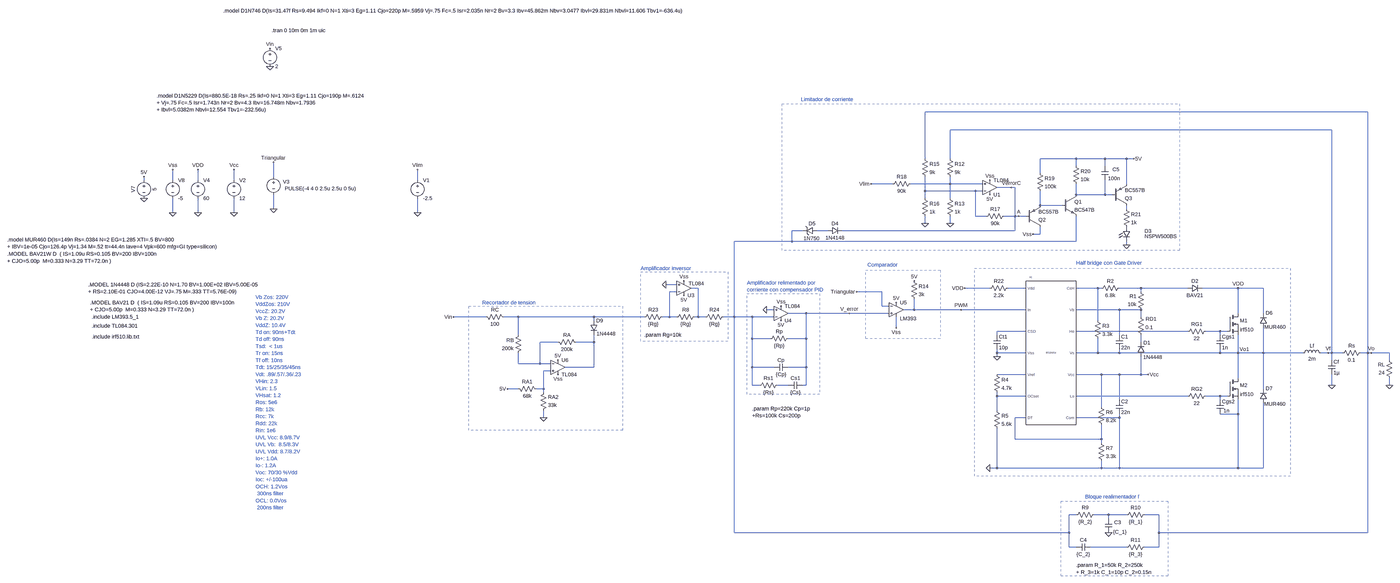
[diagram p0: schematic CIRCUITO_FINAL_POTENCIA.asc, whole sheet]
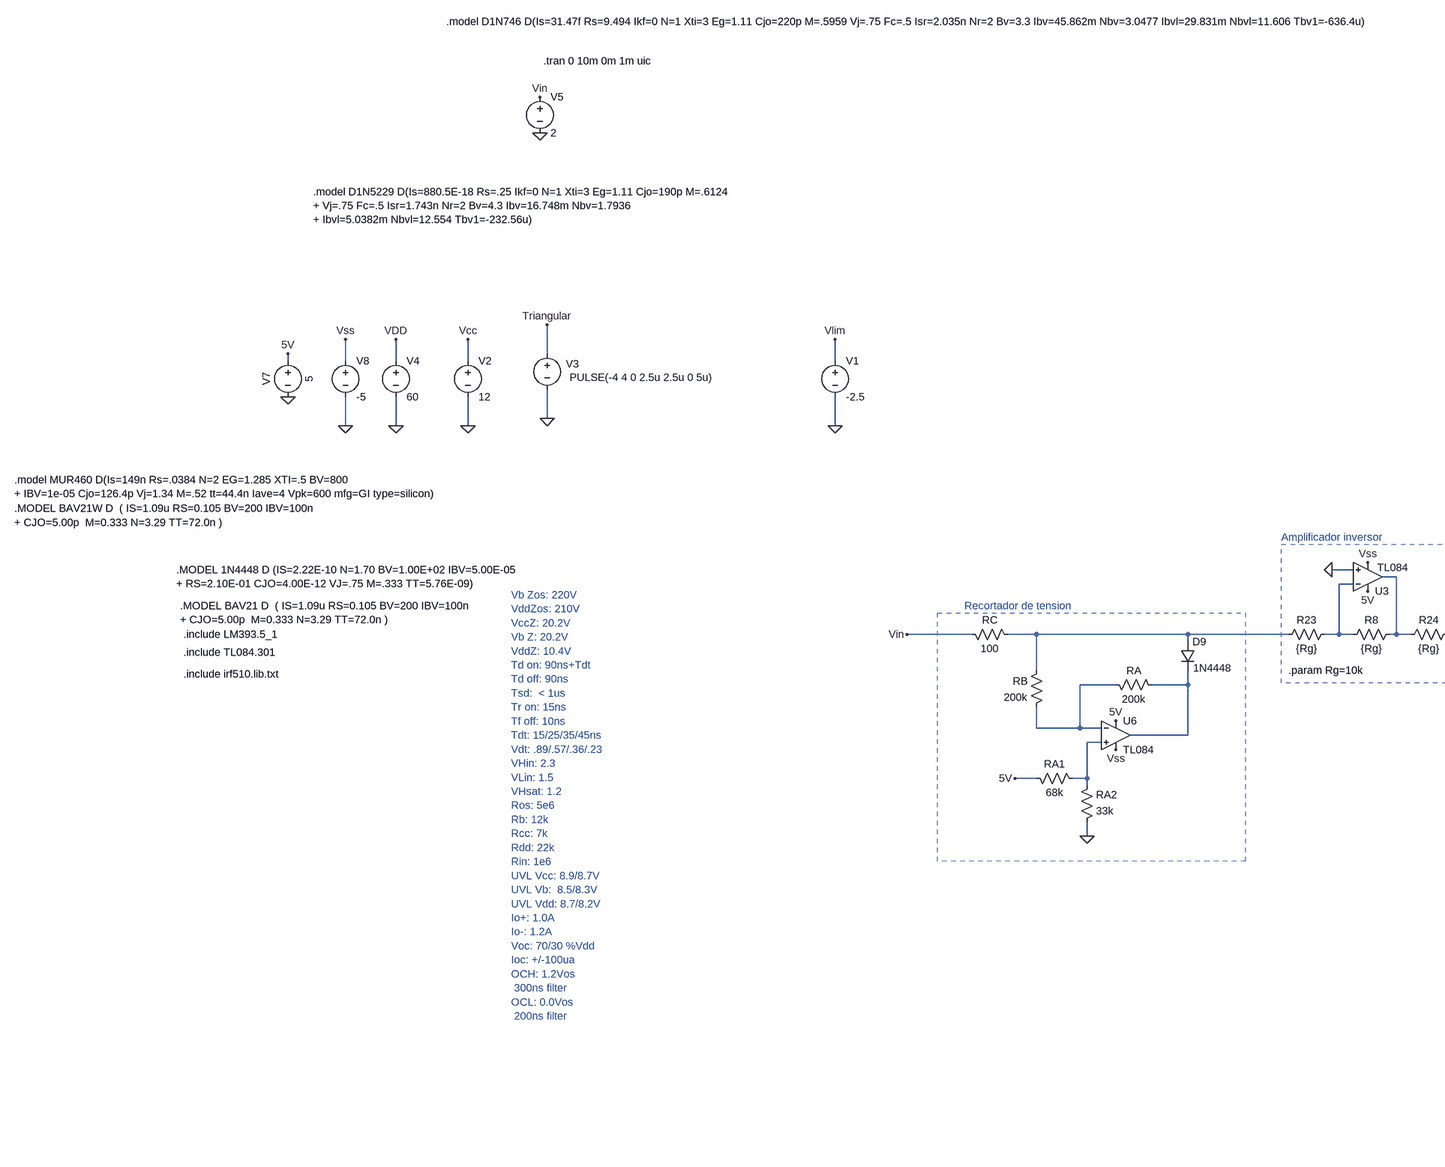
[diagram p1: schematic CIRCUITO_FINAL_POTENCIA.asc, part, row 1 of 1, column 1 of 2]
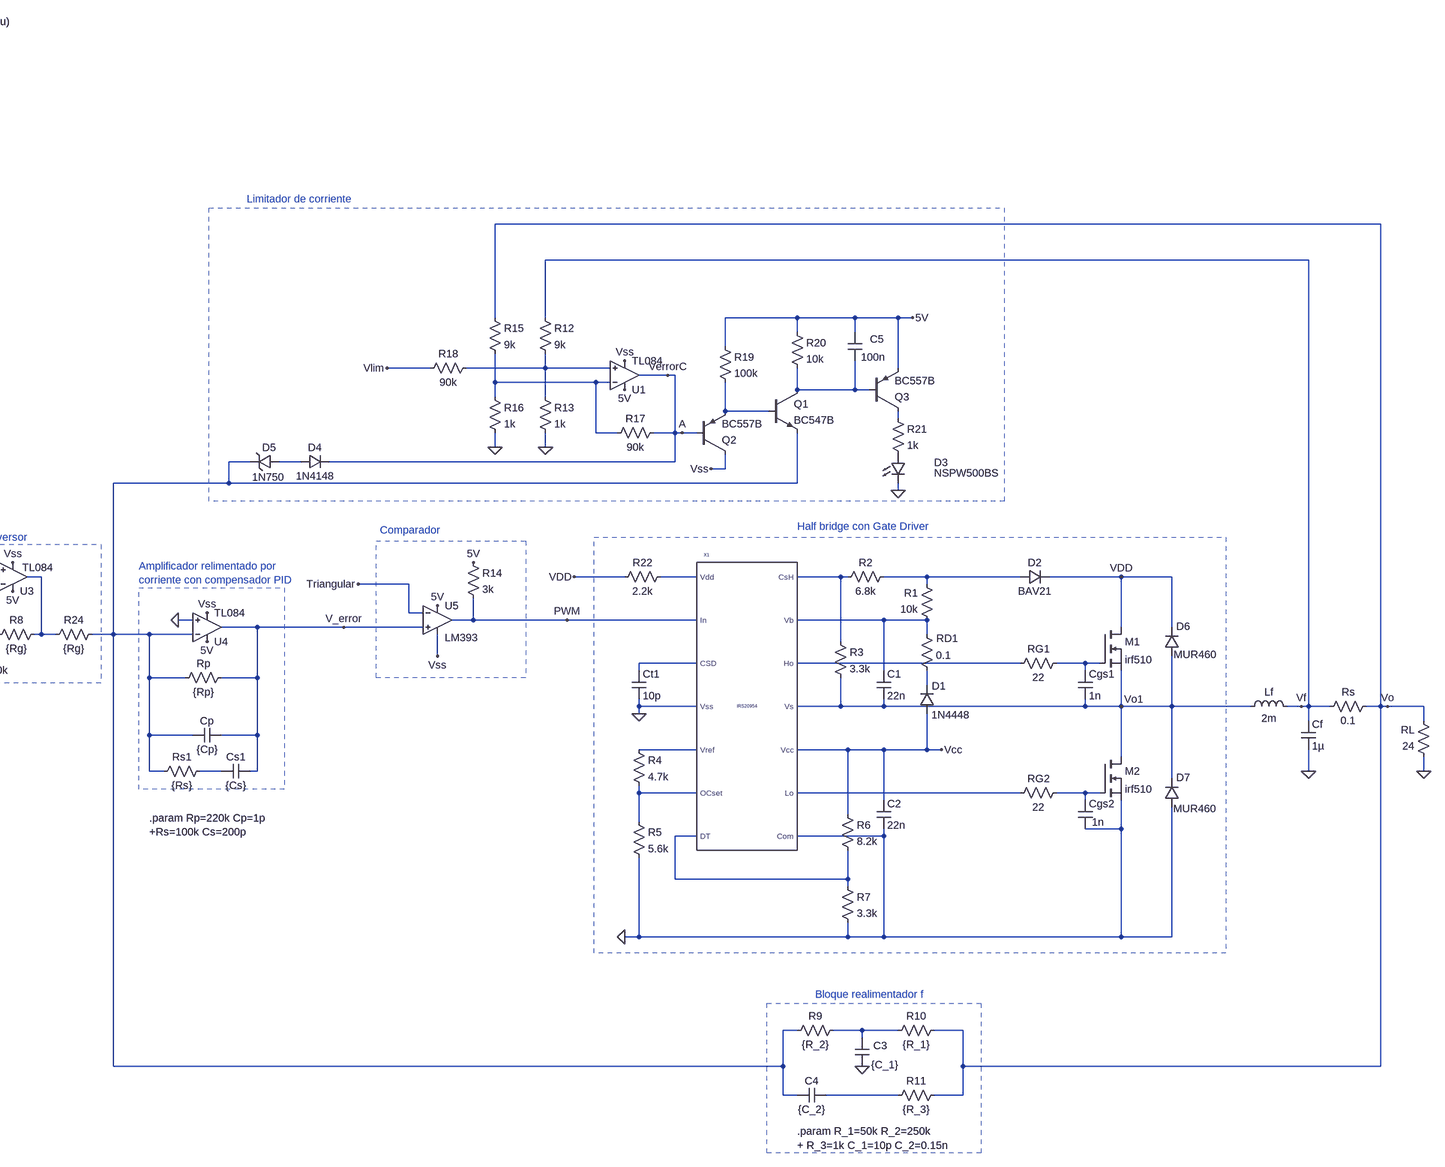
[diagram p2: schematic CIRCUITO_FINAL_POTENCIA.asc, part, row 1 of 1, column 2 of 2]
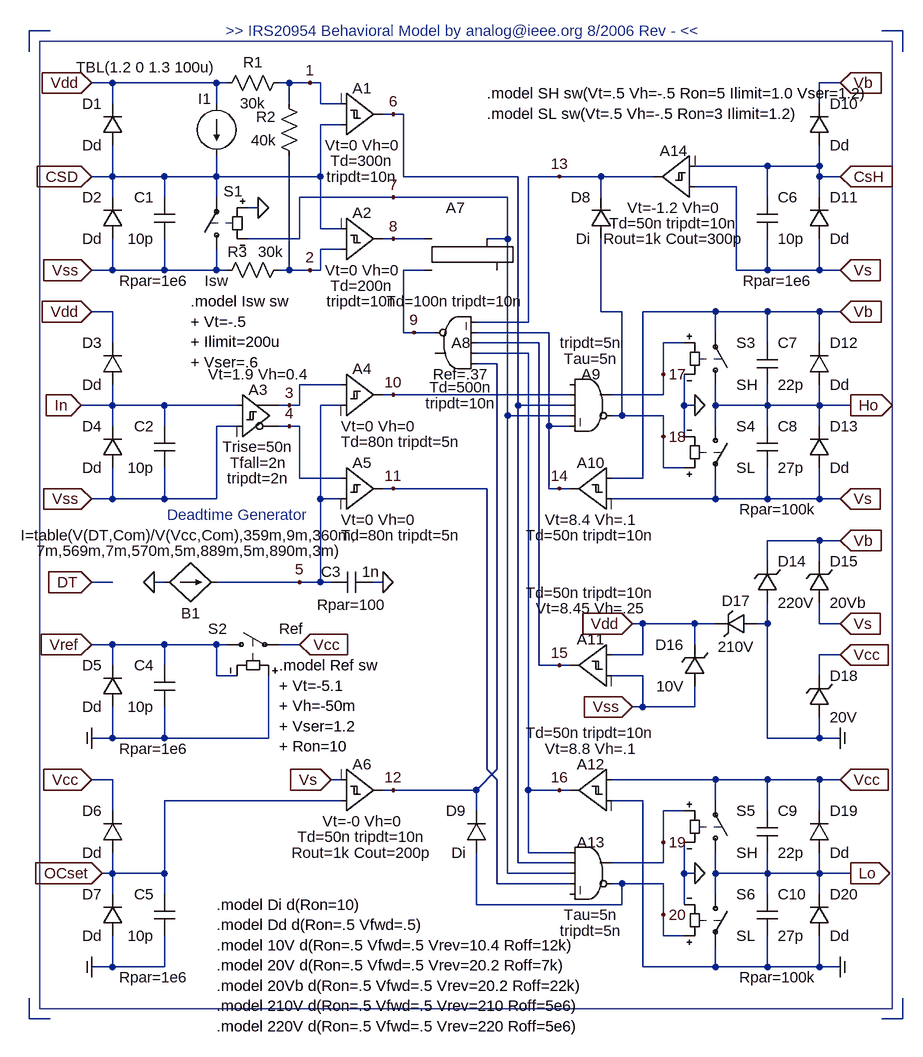
[diagram p3: sub-circuit irs20954.asc]
CIRCUITO_FINAL_POTENCIA.asc, the LTspice schematic file:
Version 4
SHEET 1 3216 2012
WIRE 1776 -784 -192 -784
WIRE 1616 -704 -80 -704
WIRE -192 -576 -192 -784
WIRE -80 -576 -80 -704
WIRE 480 -576 320 -576
WIRE 608 -576 480 -576
WIRE 704 -576 608 -576
WIRE 736 -576 704 -576
WIRE 480 -544 480 -576
WIRE 608 -544 608 -576
WIRE 320 -512 320 -576
WIRE -3088 -496 -3088 -560
WIRE -3664 -480 -3664 -496
WIRE -3536 -480 -3536 -528
WIRE -3424 -480 -3424 -528
WIRE -3264 -480 -3264 -528
WIRE -2448 -480 -2448 -528
WIRE -336 -464 -432 -464
WIRE -80 -464 -80 -496
WIRE -80 -464 -256 -464
WIRE 64 -464 -80 -464
WIRE 704 -464 704 -576
WIRE 192 -448 128 -448
WIRE 208 -448 192 -448
WIRE -192 -432 -192 -496
WIRE 32 -432 -192 -432
WIRE 64 -432 32 -432
WIRE 480 -416 480 -464
WIRE 608 -416 608 -480
WIRE 608 -416 480 -416
WIRE 640 -416 608 -416
WIRE -192 -400 -192 -432
WIRE -80 -400 -80 -464
WIRE 320 -368 320 -432
WIRE 416 -368 320 -368
WIRE -3088 -352 -3088 -416
WIRE 704 -352 704 -368
WIRE -3536 -336 -3536 -400
WIRE -3424 -336 -3424 -400
WIRE -3264 -336 -3264 -400
WIRE -2448 -336 -2448 -400
WIRE 32 -320 32 -432
WIRE 80 -320 32 -320
WIRE 208 -320 208 -448
WIRE 208 -320 160 -320
WIRE 224 -320 208 -320
WIRE 256 -320 224 -320
WIRE -192 -288 -192 -320
WIRE -80 -288 -80 -320
WIRE -736 -256 -784 -256
WIRE -624 -256 -672 -256
WIRE 208 -256 208 -320
WIRE 208 -256 -560 -256
WIRE 320 -240 320 -272
WIRE 320 -240 288 -240
WIRE -784 -208 -784 -256
WIRE -784 -208 -1040 -208
WIRE 480 -208 480 -320
WIRE 480 -208 -784 -208
WIRE 704 -192 704 -208
WIRE -1296 -16 -1344 -16
WIRE -1200 0 -1232 0
WIRE 96 0 -16 0
WIRE 256 0 176 0
WIRE 576 0 480 0
WIRE 592 0 576 0
WIRE 768 0 672 0
WIRE 976 0 768 0
WIRE 1200 0 1040 0
WIRE 1312 0 1200 0
WIRE -1296 16 -1328 16
WIRE -384 16 -496 16
WIRE 768 16 768 0
WIRE -384 80 -384 16
WIRE -352 80 -384 80
WIRE -864 96 -896 96
WIRE -240 96 -240 48
WIRE -240 96 -288 96
WIRE -32 96 -240 96
WIRE 256 96 -32 96
WIRE 672 96 480 96
WIRE 768 96 672 96
WIRE -720 112 -800 112
WIRE -528 112 -720 112
WIRE -352 112 -528 112
WIRE 1200 112 1200 0
WIRE 1312 112 1312 0
WIRE -2144 128 -2288 128
WIRE -2000 128 -2064 128
WIRE -1664 128 -2000 128
WIRE -1440 128 -1664 128
WIRE -1328 128 -1328 16
WIRE -1328 128 -1360 128
WIRE -1296 128 -1328 128
WIRE -1200 128 -1200 0
WIRE -1200 128 -1216 128
WIRE -1168 128 -1200 128
WIRE -1040 128 -1040 -208
WIRE -1040 128 -1088 128
WIRE -960 128 -1040 128
WIRE -864 128 -960 128
WIRE 768 128 768 96
WIRE -1664 144 -1664 128
WIRE 576 144 576 0
WIRE -320 176 -320 128
WIRE 256 192 128 192
WIRE 976 192 480 192
WIRE 1120 192 1056 192
WIRE 1152 192 1120 192
WIRE -2000 208 -2000 128
WIRE 128 208 128 192
WIRE 672 208 672 96
WIRE 1120 208 1120 192
WIRE -960 224 -960 128
WIRE -880 224 -960 224
WIRE -720 224 -720 112
WIRE -720 224 -800 224
WIRE -1824 240 -1904 240
WIRE -1664 240 -1664 208
WIRE -1664 240 -1744 240
WIRE 768 240 768 208
WIRE 128 288 128 272
WIRE 256 288 128 288
WIRE 576 288 576 224
WIRE 576 288 480 288
WIRE 672 288 672 272
WIRE 672 288 576 288
WIRE 1120 288 1120 272
WIRE 1120 288 672 288
WIRE 1200 288 1200 208
WIRE 1200 288 1120 288
WIRE 1312 288 1312 176
WIRE 1312 288 1200 288
WIRE 1488 288 1312 288
WIRE 1600 288 1568 288
WIRE 1616 288 1616 -704
WIRE 1616 288 1600 288
WIRE 1664 288 1616 288
WIRE 1776 288 1776 -784
WIRE 1776 288 1744 288
WIRE 1792 288 1776 288
WIRE 1872 288 1792 288
WIRE 128 304 128 288
WIRE 1616 320 1616 288
WIRE 1872 320 1872 288
WIRE -2000 336 -2000 288
WIRE -1904 336 -1904 240
WIRE -1904 336 -2000 336
WIRE -1856 336 -1904 336
WIRE -1664 352 -1664 240
WIRE -1664 352 -1792 352
WIRE -960 352 -960 224
WIRE -864 352 -960 352
WIRE -720 352 -720 224
WIRE -720 352 -800 352
WIRE -1856 368 -1888 368
WIRE 256 384 128 384
WIRE 592 384 480 384
WIRE 672 384 592 384
WIRE 768 384 768 304
WIRE 768 384 672 384
WIRE 800 384 768 384
WIRE 1200 400 1200 288
WIRE -960 432 -960 352
WIRE -928 432 -960 432
WIRE -800 432 -848 432
WIRE -720 432 -720 352
WIRE -720 432 -736 432
WIRE 1616 432 1616 384
WIRE 1872 432 1872 400
WIRE -2000 448 -2048 448
WIRE -1888 448 -1888 368
WIRE -1888 448 -1920 448
WIRE 1312 448 1312 288
WIRE -1888 464 -1888 448
WIRE 128 480 128 464
WIRE 256 480 128 480
WIRE 976 480 480 480
WIRE 1120 480 1056 480
WIRE 1152 480 1120 480
WIRE 672 496 672 384
WIRE 1120 496 1120 480
WIRE 592 528 592 384
WIRE 128 544 128 480
WIRE 1200 560 1200 496
WIRE 1200 560 1120 560
WIRE -1888 576 -1888 544
WIRE 256 576 208 576
WIRE 672 576 672 560
WIRE 672 576 480 576
WIRE 208 672 208 576
WIRE 592 672 592 608
WIRE 592 672 208 672
WIRE 592 688 592 672
WIRE 128 800 128 624
WIRE 128 800 96 800
WIRE 592 800 592 768
WIRE 592 800 128 800
WIRE 672 800 672 576
WIRE 672 800 592 800
WIRE 1200 800 1200 560
WIRE 1200 800 672 800
WIRE 1312 800 1312 512
WIRE 1312 800 1200 800
WIRE 480 1008 448 1008
WIRE 624 1008 560 1008
WIRE 704 1008 624 1008
WIRE 848 1008 784 1008
WIRE 624 1024 624 1008
WIRE -1040 1088 -1040 128
WIRE 448 1088 448 1008
WIRE 448 1088 -1040 1088
WIRE 848 1088 848 1008
WIRE 1776 1088 1776 288
WIRE 1776 1088 848 1088
WIRE 448 1152 448 1088
WIRE 480 1152 448 1152
WIRE 704 1152 544 1152
WIRE 848 1152 848 1088
WIRE 848 1152 784 1152
FLAG -3424 -336 0
FLAG -3424 -528 VDD
FLAG -3264 -336 0
FLAG -3264 -528 Vcc
FLAG 1616 432 0
FLAG -3664 -400 0
FLAG -3536 -336 0
FLAG -3536 -528 Vss
FLAG -3664 -496 5V
FLAG -528 112 V_error
FLAG -832 80 Vss
FLAG -832 144 5V
FLAG -240 -32 5V
FLAG -320 176 Vss
FLAG -320 64 5V
FLAG -1344 -16 0
FLAG -1264 -32 Vss
FLAG -1264 32 5V
FLAG 96 800 0
FLAG 1200 0 VDD
FLAG 128 304 0
FLAG 1200 288 Vo1
FLAG 800 384 Vcc
FLAG -896 96 0
FLAG -3088 -352 0
FLAG -3088 -560 Triangular
FLAG -496 16 Triangular
FLAG -3104 -1008 0
FLAG -3104 -1088 Vin
FLAG -32 96 PWM
FLAG 1872 432 0
FLAG 624 1088 0
FLAG 1600 288 Vf
FLAG 1792 288 Vo
FLAG -80 -288 0
FLAG -192 -288 0
FLAG 192 -448 VerrorC
FLAG 704 -192 0
FLAG 224 -320 A
FLAG 96 -480 Vss
FLAG 96 -416 5V
FLAG 736 -576 5V
FLAG 288 -240 Vss
FLAG -2288 128 Vin
FLAG -1824 384 Vss
FLAG -1824 320 5V
FLAG -1888 576 0
FLAG -2048 448 5V
FLAG -16 0 VDD
FLAG -432 -464 Vlim
FLAG -2448 -336 0
FLAG -2448 -528 Vlim
SYMBOL voltage -3264 -496 R0
SYMATTR InstName V2
SYMATTR Value 12
SYMBOL voltage -3424 -496 R0
WINDOW 123 0 0 Left 2
WINDOW 39 0 0 Left 2
SYMATTR InstName V4
SYMATTR Value 60
SYMBOL ind 1472 304 R270
WINDOW 0 32 56 VTop 2
WINDOW 3 5 56 VBottom 2
SYMATTR InstName Lf
SYMATTR Value 2m
SYMBOL cap 1600 320 R0
SYMATTR InstName Cf
SYMATTR Value 1µ
SYMBOL voltage -3664 -496 R0
WINDOW 0 -32 56 VBottom 2
WINDOW 3 32 56 VTop 2
WINDOW 123 0 0 Left 2
WINDOW 39 0 0 Left 2
SYMATTR InstName V7
SYMATTR Value 5
SYMBOL voltage -3536 -496 R0
WINDOW 123 0 0 Left 2
WINDOW 39 0 0 Left 2
SYMATTR InstName V8
SYMATTR Value -5
SYMBOL res 576 992 R90
WINDOW 0 0 56 VBottom 2
WINDOW 3 32 56 VTop 2
SYMATTR InstName R9
SYMATTR Value {R_2}
SYMBOL res 800 992 R90
WINDOW 0 0 56 VBottom 2
WINDOW 3 32 56 VTop 2
SYMATTR InstName R10
SYMATTR Value {R_1}
SYMBOL cap 640 1088 R180
WINDOW 0 -40 46 Left 2
WINDOW 3 -65 4 Left 2
SYMATTR InstName C3
SYMATTR Value {C_1}
SYMBOL cap 544 1136 R90
WINDOW 0 0 32 VBottom 2
WINDOW 3 32 32 VTop 2
SYMATTR InstName C4
SYMATTR Value {C_2}
SYMBOL res 800 1136 R90
WINDOW 0 0 56 VBottom 2
WINDOW 3 32 56 VTop 2
SYMATTR InstName R11
SYMATTR Value {R_3}
SYMBOL res -784 208 R90
WINDOW 0 0 56 VBottom 2
WINDOW 3 32 56 VTop 2
SYMATTR InstName Rp
SYMATTR Value {Rp}
SYMBOL cap -800 336 R90
WINDOW 0 0 32 VBottom 2
WINDOW 3 32 32 VTop 2
SYMATTR InstName Cp
SYMATTR Value {Cp}
SYMBOL opamp2 -832 176 M180
SYMATTR InstName U4
SYMATTR Value TL084
SYMBOL opamp2 -320 32 R0
WINDOW 3 16 103 Left 2
SYMATTR Value LM393
SYMATTR InstName U5
SYMBOL res -256 -48 R0
SYMATTR InstName R14
SYMATTR Value 3k
SYMBOL res -1200 112 R90
WINDOW 0 0 56 VBottom 2
WINDOW 3 32 56 VTop 2
SYMATTR InstName R8
SYMATTR Value {Rg}
SYMBOL res -1344 112 R90
WINDOW 0 0 56 VBottom 2
WINDOW 3 32 56 VTop 2
SYMATTR InstName R23
SYMATTR Value {Rg}
SYMBOL res -1072 112 R90
WINDOW 0 0 56 VBottom 2
WINDOW 3 32 56 VTop 2
SYMATTR InstName R24
SYMATTR Value {Rg}
SYMBOL opamp2 -1264 64 M180
WINDOW 3 21 85 Left 2
SYMATTR Value TL084
SYMATTR InstName U3
SYMBOL cap 656 208 R0
SYMATTR InstName C1
SYMATTR Value 22n
SYMBOL cap 112 208 R0
SYMATTR InstName Ct1
SYMATTR Value 10p
SYMBOL cap 656 496 R0
SYMATTR InstName C2
SYMATTR Value 22n
SYMBOL nmos 1152 112 R0
SYMATTR InstName M1
SYMATTR Value irf510
SYMATTR Prefix X
SYMBOL res 752 112 R0
WINDOW 0 37 25 Left 2
WINDOW 3 36 62 Left 2
SYMATTR InstName RD1
SYMATTR Value 0.1
SYMBOL res 1072 176 R90
WINDOW 0 0 56 VBottom 2
WINDOW 3 32 56 VTop 2
SYMATTR InstName RG1
SYMATTR Value 22
SYMBOL res 1072 464 R90
WINDOW 0 0 56 VBottom 2
WINDOW 3 32 56 VTop 2
SYMATTR InstName RG2
SYMATTR Value 22
SYMBOL res 560 128 R0
SYMATTR InstName R3
SYMATTR Value 3.3k
SYMBOL res 688 -16 R90
WINDOW 0 0 56 VBottom 2
WINDOW 3 32 56 VTop 2
SYMATTR InstName R2
SYMATTR Value 6.8k
SYMBOL res 784 112 R180
WINDOW 0 36 76 Left 2
WINDOW 3 36 40 Left 2
SYMATTR InstName R1
SYMATTR Value 10k
SYMBOL res 112 528 R0
SYMATTR InstName R5
SYMATTR Value 5.6k
SYMBOL res 112 368 R0
SYMATTR InstName R4
SYMATTR Value 4.7k
SYMBOL IRS20954 368 288 R0
SYMATTR InstName X1
SYMBOL voltage -3088 -512 R0
WINDOW 123 0 0 Left 2
WINDOW 39 0 0 Left 2
WINDOW 3 369 69 Right 2
WINDOW 0 42 39 Left 2
SYMATTR Value PULSE(-4 4 0 2.5u 2.5u 0 5u)
SYMATTR InstName V3
SYMBOL diode 1328 176 R180
WINDOW 0 -25 66 Left 2
WINDOW 3 -84 3 Left 2
SYMATTR InstName D6
SYMATTR Value MUR460
SYMBOL diode 1328 512 R180
WINDOW 0 -25 66 Left 2
WINDOW 3 -83 -3 Left 2
SYMATTR InstName D7
SYMATTR Value MUR460
SYMBOL diode 976 16 R270
WINDOW 0 32 32 VTop 2
WINDOW 3 0 32 VBottom 2
SYMATTR InstName D2
SYMATTR Value BAV21
SYMBOL cap 1104 208 R0
SYMATTR InstName Cgs1
SYMATTR Value 1n
SYMBOL cap 1104 496 R0
WINDOW 3 31 49 Left 2
SYMATTR Value 1n
SYMATTR InstName Cgs2
SYMBOL diode 784 304 R180
WINDOW 0 -26 61 Left 2
WINDOW 3 -79 -3 Left 2
SYMATTR InstName D1
SYMATTR Value 1N4448
SYMBOL res 576 672 R0
SYMATTR InstName R7
SYMATTR Value 3.3k
SYMBOL res 576 512 R0
SYMATTR InstName R6
SYMATTR Value 8.2k
SYMBOL voltage -3104 -1104 R0
SYMATTR InstName V5
SYMATTR Value 2
SYMBOL nmos 1152 400 R0
SYMATTR InstName M2
SYMATTR Value irf510
SYMATTR Prefix X
SYMBOL res 1888 416 R180
WINDOW 0 36 76 Left 2
WINDOW 3 36 40 Left 2
SYMATTR InstName RL
SYMATTR Value 24
SYMBOL res 1760 272 R90
WINDOW 0 0 56 VBottom 2
WINDOW 3 32 56 VTop 2
SYMATTR InstName Rs
SYMATTR Value 0.1
SYMBOL res -96 -592 R0
SYMATTR InstName R12
SYMATTR Value 9k
SYMBOL res -96 -416 R0
SYMATTR InstName R13
SYMATTR Value 1k
SYMBOL res -208 -592 R0
SYMATTR InstName R15
SYMATTR Value 9k
SYMBOL res -208 -416 R0
SYMATTR InstName R16
SYMATTR Value 1k
SYMBOL res 176 -336 R90
WINDOW 0 0 56 VBottom 2
WINDOW 3 32 56 VTop 2
SYMATTR InstName R17
SYMATTR Value 90k
SYMBOL res -240 -480 R90
WINDOW 0 0 56 VBottom 2
WINDOW 3 32 56 VTop 2
SYMATTR InstName R18
SYMATTR Value 90k
SYMBOL npn 416 -416 R0
SYMATTR InstName Q1
SYMATTR Value BC547B
SYMBOL pnp 256 -272 M180
SYMATTR InstName Q2
SYMATTR Value BC557B
SYMBOL res 304 -528 R0
SYMATTR InstName R19
SYMATTR Value 100k
SYMBOL LED 688 -272 R0
WINDOW 0 96 18 Left 2
WINDOW 3 96 41 Left 2
SYMATTR InstName D3
SYMATTR Value NSPW500BS
SYMBOL res 464 -560 R0
SYMATTR InstName R20
SYMATTR Value 10k
SYMBOL pnp 640 -368 M180
SYMATTR InstName Q3
SYMATTR Value BC557B
SYMBOL res 688 -368 R0
SYMATTR InstName R21
SYMATTR Value 1k
SYMBOL cap 624 -480 R180
WINDOW 0 -48 48 Left 2
WINDOW 3 -51 8 Left 2
SYMATTR InstName C5
SYMATTR Value 100n
SYMBOL diode -624 -240 R270
WINDOW 0 32 32 VTop 2
WINDOW 3 0 32 VBottom 2
SYMATTR InstName D4
SYMATTR Value 1N4148
SYMBOL zener -672 -272 R90
WINDOW 0 0 22 VBottom 2
WINDOW 3 35 24 VTop 2
SYMATTR InstName D5
SYMATTR Value 1N750
SYMATTR Description Diode
SYMATTR Type diode
SYMBOL opamp2 96 -384 M180
SYMATTR InstName U1
SYMATTR Value TL084
SYMBOL res -832 416 R90
WINDOW 0 0 56 VBottom 2
WINDOW 3 32 56 VTop 2
SYMATTR InstName Rs1
SYMATTR Value {Rs}
SYMBOL cap -736 416 R90
WINDOW 0 0 32 VBottom 2
WINDOW 3 32 32 VTop 2
SYMATTR InstName Cs1
SYMATTR Value {Cs}
SYMBOL opamp2 -1824 288 R0
SYMATTR InstName U6
SYMATTR Value TL084
SYMBOL res -1728 256 M270
WINDOW 0 32 56 VTop 2
WINDOW 3 0 56 VBottom 2
SYMATTR InstName RA
SYMATTR Value 200k
SYMBOL diode -1648 144 M0
WINDOW 0 -25 0 Left 2
WINDOW 3 -81 59 Left 2
SYMATTR InstName D9
SYMATTR Value 1N4448
SYMBOL res -2048 144 M270
WINDOW 0 32 56 VTop 2
WINDOW 3 0 56 VBottom 2
SYMATTR InstName RC
SYMATTR Value 100
SYMBOL res -1984 192 M0
SYMATTR InstName RB
SYMATTR Value 200k
SYMBOL res -1904 464 M270
WINDOW 0 32 56 VTop 2
WINDOW 3 0 56 VBottom 2
SYMATTR InstName RA1
SYMATTR Value 68k
SYMBOL res -1904 560 M180
WINDOW 0 36 76 Left 2
WINDOW 3 36 40 Left 2
SYMATTR InstName RA2
SYMATTR Value 33k
SYMBOL res 192 -16 R90
WINDOW 0 0 56 VBottom 2
WINDOW 3 32 56 VTop 2
SYMATTR InstName R22
SYMATTR Value 2.2k
SYMBOL voltage -2448 -496 R0
SYMATTR InstName V1
SYMATTR Value -2.5
TEXT -3168 40 Left 2 ;Vb Zos: 220V\nVddZos: 210V\nVccZ: 20.2V\nVb Z: 20.2V\nVddZ: 10.4V\nTd on: 90ns+Tdt\nTd off: 90ns\nTsd:  < 1us\nTr on: 15ns\nTf off: 10ns\nTdt: 15/25/35/45ns\nVdt: .89/.57/.36/.23\nVHin: 2.3\nVLin: 1.5\nVHsat: 1.2\nRos: 5e6\nRb: 12k\nRcc: 7k\nRdd: 22k\nRin: 1e6\nUVL Vcc: 8.9/8.7V\nUVL Vb:  8.5/8.3V\nUVL Vdd: 8.7/8.2V\nIo+: 1.0A\nIo-: 1.2A\nVoc: 70/30 %Vdd\nIoc: +/-100ua\nOCH: 1.2Vos\n 300ns filter\nOCL: 0.0Vos\n 200ns filter
TEXT -4272 -216 Left 2 !.model MUR460 D(Is=149n Rs=.0384 N=2 EG=1.285 XTI=.5 BV=800 \n+ IBV=1e-05 Cjo=126.4p Vj=1.34 M=.52 tt=44.4n Iave=4 Vpk=600 mfg=GI type=silicon)
TEXT -4272 -152 Left 2 !.MODEL BAV21W D  ( IS=1.09u RS=0.105 BV=200 IBV=100n\n+ CJO=5.00p  M=0.333 N=3.29 TT=72.0n )
TEXT -3896 128 Left 2 !.include LM393.5_1
TEXT -3896 168 Left 2 !.include TL084.301
TEXT -1440 208 Left 2 !.param Rg=10k
TEXT -3904 64 Left 2 !.MODEL BAV21 D  ( IS=1.09u RS=0.105 BV=200 IBV=100n\n+ CJO=5.00p  M=0.333 N=3.29 TT=72.0n )
TEXT -3912 -16 Left 2 !.MODEL 1N4448 D (IS=2.22E-10 N=1.70 BV=1.00E+02 IBV=5.00E-05\n+ RS=2.10E-01 CJO=4.00E-12 VJ=.75 M=.333 TT=5.76E-09)
TEXT -3896 216 Left 2 !.include irf510.lib.txt
TEXT 480 1232 Left 2 !.param R_1=50k R_2=250k \n+ R_3=1k C_1=10p C_2=0.15n
TEXT -1456 -88 Left 2 ;Amplificador inversor
TEXT -960 536 Left 2 !.param Rp=220k Cp=1p\n+Rs=100k Cs=200p
TEXT -984 -24 Left 2 ;Amplificador relimentado por \ncorriente con compensador PID
TEXT -448 -104 Left 2 ;Comparador
TEXT 480 -112 Left 2 ;Half bridge con Gate Driver
TEXT 520 928 Left 2 ;Bloque realimentador f
TEXT -3096 -1168 Left 2 !.tran 0 10m 0m 1m uic
TEXT -744 -840 Left 2 ;Limitador de corriente
TEXT -2160 64 Left 2 ;Recortador de tension
TEXT -3312 -1256 Left 2 !.model D1N746 D(Is=31.47f Rs=9.494 Ikf=0 N=1 Xti=3 Eg=1.11 Cjo=220p M=.5959 Vj=.75 Fc=.5 Isr=2.035n Nr=2 Bv=3.3 Ibv=45.862m Nbv=3.0477 Ibvl=29.831m Nbvl=11.606 Tbv1=-636.4u)
TEXT -3608 -856 Left 2 !.model D1N5229 D(Is=880.5E-18 Rs=.25 Ikf=0 N=1 Xti=3 Eg=1.11 Cjo=190p M=.6124 \n+ Vj=.75 Fc=.5 Isr=1.743n Nr=2 Bv=4.3 Ibv=16.748m Nbv=1.7936\n+ Ibvl=5.0382m Nbvl=12.554 Tbv1=-232.56u)
RECTANGLE Normal -984 24 -660 472 2
RECTANGLE Normal -456 -80 -124 224 2
RECTANGLE Normal 28 -88 1432 836 2
RECTANGLE Normal 412 948 888 1280 2
RECTANGLE Normal -1456 -72 -1068 236 2
RECTANGLE Normal 940 -168 -828 -820 2
RECTANGLE Normal -2220 80 -1536 632 2

irs20954.asc, the sub-circuit schematic file:
Version 4
SHEET 1 13828 1048
WIRE -480 -576 -512 -576
WIRE 832 -576 800 -576
WIRE -512 -544 -512 -576
WIRE 832 -544 832 -576
WIRE -384 -496 -416 -496
WIRE -224 -496 -384 -496
WIRE -208 -496 -224 -496
WIRE -112 -496 -128 -496
WIRE -80 -496 -112 -496
WIRE -64 -496 -80 -496
WIRE 736 -496 704 -496
WIRE -384 -464 -384 -496
WIRE -224 -464 -224 -496
WIRE -112 -464 -112 -496
WIRE -64 -464 -64 -496
WIRE -32 -464 -64 -464
WIRE 704 -464 704 -496
WIRE 48 -448 32 -448
WIRE 64 -448 48 -448
WIRE -32 -432 -64 -432
WIRE 624 -368 512 -368
WIRE 704 -368 704 -400
WIRE 704 -368 624 -368
WIRE -384 -352 -384 -400
WIRE -384 -352 -416 -352
WIRE -304 -352 -384 -352
WIRE -224 -352 -224 -384
WIRE -224 -352 -304 -352
WIRE -64 -352 -64 -432
WIRE -64 -352 -224 -352
WIRE 64 -352 64 -448
WIRE 240 -352 64 -352
WIRE 304 -352 256 -352
WIRE 368 -352 304 -352
WIRE 448 -352 368 -352
WIRE 704 -352 704 -368
WIRE 736 -352 704 -352
WIRE 576 -336 512 -336
WIRE -384 -320 -384 -352
WIRE -304 -320 -304 -352
WIRE -224 -320 -224 -352
WIRE 48 -320 -96 -320
WIRE 224 -320 48 -320
WIRE 368 -320 368 -352
WIRE 624 -320 624 -368
WIRE 704 -320 704 -352
WIRE -160 -304 -176 -304
WIRE -64 -272 -64 -352
WIRE -32 -272 -64 -272
WIRE -96 -256 -96 -320
WIRE -96 -256 -176 -256
WIRE 48 -256 32 -256
WIRE 96 -256 48 -256
WIRE 224 -256 224 -320
WIRE 224 -256 192 -256
WIRE -32 -240 -64 -240
WIRE -384 -208 -384 -256
WIRE -384 -208 -416 -208
WIRE -304 -208 -304 -256
WIRE -304 -208 -384 -208
WIRE -224 -208 -224 -240
WIRE -224 -208 -304 -208
WIRE -208 -208 -224 -208
WIRE -112 -208 -112 -384
WIRE -112 -208 -128 -208
WIRE -80 -208 -112 -208
WIRE -64 -208 -64 -240
WIRE -64 -208 -80 -208
WIRE 96 -208 64 -208
WIRE 576 -208 576 -336
WIRE 624 -208 624 -256
WIRE 624 -208 576 -208
WIRE 704 -208 704 -256
WIRE 704 -208 624 -208
WIRE 736 -208 704 -208
WIRE -384 -144 -416 -144
WIRE 368 -144 368 -256
WIRE 400 -144 368 -144
WIRE 544 -144 432 -144
WIRE 624 -144 544 -144
WIRE 704 -144 624 -144
WIRE 736 -144 704 -144
WIRE 256 -128 256 -352
WIRE 256 -128 176 -128
WIRE 64 -112 64 -208
WIRE 80 -112 64 -112
WIRE 112 -112 80 -112
WIRE 288 -112 176 -112
WIRE 544 -112 544 -144
WIRE -384 -96 -384 -144
WIRE 272 -96 176 -96
WIRE 496 -96 464 -96
WIRE 624 -96 624 -144
WIRE 704 -96 704 -144
WIRE 256 -80 176 -80
WIRE 208 -64 176 -64
WIRE 464 -48 464 -96
WIRE -32 -32 -96 -32
WIRE 48 -16 32 -16
WIRE 320 -16 48 -16
WIRE 464 -16 464 -48
WIRE 464 -16 384 -16
WIRE -384 0 -384 -32
WIRE -384 0 -432 0
WIRE -304 0 -384 0
WIRE -192 0 -304 0
WIRE -112 0 -128 0
WIRE -96 0 -96 -32
WIRE -96 0 -112 0
WIRE -32 0 -64 0
WIRE 240 0 240 -352
WIRE 320 0 240 0
WIRE 496 0 496 -48
WIRE 512 0 496 0
WIRE 544 0 544 -32
WIRE 624 0 624 -32
WIRE 624 0 544 0
WIRE 704 0 704 -32
WIRE 704 0 624 0
WIRE 752 0 704 0
WIRE 224 16 224 -256
WIRE 320 16 224 16
WIRE 400 16 400 -144
WIRE 400 16 384 16
WIRE 464 16 400 16
WIRE -384 32 -384 0
WIRE -304 32 -304 0
WIRE -192 32 -224 32
WIRE -112 32 -128 32
WIRE -96 32 -112 32
WIRE 288 32 288 -112
WIRE 320 32 288 32
WIRE 544 32 544 0
WIRE 624 32 624 0
WIRE 704 32 704 0
WIRE 464 48 464 16
WIRE 496 48 496 0
WIRE 464 96 464 48
WIRE 496 96 464 96
WIRE -96 112 -96 32
WIRE -32 112 -96 112
WIRE 432 112 432 -144
WIRE 432 112 384 112
WIRE 48 128 32 128
WIRE 192 128 48 128
WIRE 288 128 288 32
WIRE 304 128 288 128
WIRE 320 128 304 128
WIRE -384 144 -384 96
WIRE -384 144 -416 144
WIRE -304 144 -304 96
WIRE -304 144 -384 144
WIRE -224 144 -224 32
WIRE -224 144 -304 144
WIRE -64 144 -64 0
WIRE -32 144 -64 144
WIRE 544 144 544 112
WIRE 544 144 384 144
WIRE 624 144 624 96
WIRE 624 144 544 144
WIRE 704 144 704 96
WIRE 704 144 624 144
WIRE 736 144 704 144
WIRE 704 208 624 208
WIRE 736 208 704 208
WIRE 624 240 624 208
WIRE 704 240 704 208
WIRE -384 272 -416 272
WIRE -304 272 -320 272
WIRE -96 272 -224 272
WIRE -64 272 -64 144
WIRE -64 272 -96 272
WIRE -48 272 -64 272
WIRE 32 272 16 272
WIRE 432 336 416 336
WIRE 512 336 432 336
WIRE 544 336 512 336
WIRE 624 336 624 304
WIRE 624 336 608 336
WIRE 704 336 704 304
WIRE 736 336 704 336
WIRE -384 368 -416 368
WIRE -304 368 -384 368
WIRE -224 368 -304 368
WIRE -208 368 -224 368
WIRE -96 368 -128 368
WIRE 512 368 512 336
WIRE 432 384 432 336
WIRE 432 384 384 384
WIRE 736 384 704 384
WIRE -384 400 -384 368
WIRE -304 400 -304 368
WIRE 272 400 272 -96
WIRE 304 400 272 400
WIRE 320 400 304 400
WIRE -224 416 -224 368
WIRE -192 416 -224 416
WIRE 432 416 384 416
WIRE 704 416 704 384
WIRE 432 464 432 416
WIRE 432 464 416 464
WIRE 512 464 512 432
WIRE 512 464 432 464
WIRE -384 512 -384 464
WIRE -384 512 -416 512
WIRE -304 512 -304 464
WIRE -304 512 -384 512
WIRE -144 512 -144 416
WIRE -144 512 -304 512
WIRE 624 512 624 336
WIRE 704 512 704 480
WIRE 704 512 624 512
WIRE 736 512 704 512
WIRE 192 560 192 128
WIRE 208 560 208 -64
WIRE -384 576 -416 576
WIRE -32 576 -48 576
WIRE 208 576 192 560
WIRE 544 576 384 576
WIRE 624 576 544 576
WIRE 704 576 624 576
WIRE 736 576 704 576
WIRE 48 592 32 592
WIRE 176 592 208 560
WIRE 176 592 48 592
WIRE 256 592 256 -80
WIRE 304 592 256 592
WIRE 320 592 304 592
WIRE -32 608 -304 608
WIRE 432 608 384 608
WIRE 544 608 544 576
WIRE -384 624 -384 576
WIRE 176 624 176 592
WIRE 496 624 464 624
WIRE 624 624 624 576
WIRE 704 624 704 576
WIRE 464 672 464 624
WIRE 256 688 256 592
WIRE 320 688 256 688
WIRE 240 704 240 0
WIRE 320 704 240 704
WIRE 464 704 464 672
WIRE 464 704 384 704
WIRE -384 720 -384 688
WIRE -384 720 -400 720
WIRE -304 720 -304 608
WIRE -304 720 -384 720
WIRE 224 720 224 16
WIRE 320 720 224 720
WIRE 496 720 496 672
WIRE 512 720 496 720
WIRE 544 720 544 688
WIRE 624 720 624 688
WIRE 624 720 544 720
WIRE 704 720 704 688
WIRE 704 720 624 720
WIRE 752 720 704 720
WIRE 208 736 208 576
WIRE 320 736 208 736
WIRE 400 736 384 736
WIRE 464 736 400 736
WIRE -384 752 -384 720
WIRE -304 752 -304 720
WIRE 544 752 544 720
WIRE 624 752 624 720
WIRE 704 752 704 720
WIRE 176 768 176 688
WIRE 400 768 400 736
WIRE 400 768 176 768
WIRE 496 768 496 720
WIRE 464 784 464 736
WIRE 464 816 464 784
WIRE 496 816 464 816
WIRE -384 864 -384 816
WIRE -384 864 -416 864
WIRE -304 864 -304 816
WIRE -304 864 -384 864
WIRE 432 864 432 608
WIRE 544 864 544 832
WIRE 544 864 432 864
WIRE 624 864 624 816
WIRE 624 864 544 864
WIRE 704 864 704 816
WIRE 704 864 624 864
WIRE 736 864 704 864
WIRE -512 944 -512 912
WIRE -480 944 -512 944
WIRE 832 944 832 912
WIRE 832 944 800 944
FLAG 752 0 Ho
IOPIN 752 0 Out
FLAG -432 0 In
IOPIN -432 0 In
FLAG -416 -144 Vdd
IOPIN -416 -144 In
FLAG 736 -144 Vb
IOPIN 736 -144 In
FLAG 736 144 Vs
IOPIN 736 144 In
FLAG -416 144 Vss
IOPIN -416 144 In
FLAG 736 512 Com
IOPIN 736 512 In
FLAG 736 576 Vcc
IOPIN 736 576 In
FLAG 736 864 Com
IOPIN 736 864 In
FLAG 752 720 Lo
IOPIN 752 720 Out
FLAG -96 272 5
FLAG 512 720 0
FLAG 512 0 0
FLAG 80 -112 9
FLAG 464 -48 17
FLAG 464 48 18
FLAG 736 384 Vcc
IOPIN 736 384 In
FLAG 736 208 Vb
IOPIN 736 208 In
FLAG 736 336 Vs
IOPIN 736 336 In
FLAG -112 0 3
FLAG 304 -352 13
FLAG 304 128 14
FLAG -112 32 4
FLAG 48 -16 10
FLAG -400 720 OCset
IOPIN -400 720 In
FLAG 32 272 0
FLAG -320 272 0
FLAG -416 272 DT
IOPIN -416 272 In
FLAG 464 672 19
FLAG 464 784 20
FLAG 416 464 Vss
IOPIN 416 464 In
FLAG 416 336 Vdd
IOPIN 416 336 In
FLAG 736 -352 CsH
IOPIN 736 -352 In
FLAG 736 -496 Vb
IOPIN 736 -496 In
FLAG 736 -208 Vs
IOPIN 736 -208 In
FLAG -416 -352 CSD
IOPIN -416 -352 In
FLAG -416 -496 Vdd
IOPIN -416 -496 In
FLAG -416 -208 Vss
IOPIN -416 -208 In
FLAG -160 -304 0
FLAG -416 368 Vref
IOPIN -416 368 In
FLAG -48 576 Vs
IOPIN -48 576 In
FLAG -416 576 Vcc
IOPIN -416 576 In
FLAG -416 864 Com
IOPIN -416 864 In
FLAG -80 -496 1
FLAG -80 -208 2
FLAG 48 128 11
FLAG 48 -448 6
FLAG 48 -320 7
FLAG 48 -256 8
FLAG 48 592 12
FLAG 304 400 15
FLAG 304 592 16
FLAG -96 368 Vcc
IOPIN -96 368 In
FLAG -416 512 Com
IOPIN -416 512 In
SYMBOL diode -368 -400 R180
WINDOW 0 32 64 Left 0
WINDOW 3 32 0 Left 0
SYMATTR InstName D1
SYMATTR Value Dd
SYMBOL diode -368 -256 R180
WINDOW 0 32 64 Left 0
WINDOW 3 32 0 Left 0
SYMATTR InstName D2
SYMATTR Value Dd
SYMBOL cap -288 -320 M0
WINDOW 0 32 0 Left 0
WINDOW 3 32 64 Left 0
WINDOW 39 32 128 Center 0
SYMATTR InstName C1
SYMATTR Value 10p
SYMATTR SpiceLine Rpar=1e6
SYMBOL current -224 -464 R0
WINDOW 123 0 0 Left 0
WINDOW 39 0 0 Left 0
WINDOW 3 0 -56 Right 0
WINDOW 0 -8 -8 Right 0
SYMATTR Value TBL(1.2 0 1.3 100u)
SYMATTR InstName I1
SYMBOL sw -224 -224 R180
WINDOW 0 -11 105 Right 0
WINDOW 3 0 -32 Center 0
SYMATTR InstName S1
SYMATTR Value Isw
SYMBOL res -224 -480 R270
WINDOW 0 32 56 VTop 0
WINDOW 3 0 56 VBottom 0
SYMATTR InstName R1
SYMATTR Value 30k
SYMBOL res -96 -368 R180
WINDOW 0 36 76 Left 0
WINDOW 3 36 40 Left 0
SYMATTR InstName R2
SYMATTR Value 40k
SYMBOL res -112 -224 R90
WINDOW 0 -12 64 VRight 0
WINDOW 3 -12 48 VLeft 0
SYMATTR InstName R3
SYMATTR Value 30k
SYMBOL Digital\\diffschmtbuf -32 -384 M180
WINDOW 0 32 104 Center 0
WINDOW 3 32 16 Center 0
WINDOW 123 32 -8 Center 0
WINDOW 39 32 -32 Center 0
SYMATTR InstName A1
SYMATTR Value Vt=0 Vh=0
SYMATTR Value2 Td=300n
SYMATTR SpiceLine tripdt=10n
SYMBOL Digital\\diffschmtbuf -32 -192 M180
WINDOW 0 32 104 Center 0
WINDOW 3 32 16 Center 0
WINDOW 123 32 -8 Center 0
WINDOW 39 32 -32 Center 0
SYMATTR InstName A2
SYMATTR Value Vt=0 Vh=0
SYMATTR Value2 Td=200n
SYMATTR SpiceLine tripdt=10n
SYMBOL diode -368 -32 R180
WINDOW 0 32 64 Left 0
WINDOW 3 32 0 Left 0
SYMATTR InstName D3
SYMATTR Value Dd
SYMBOL diode -368 96 R180
WINDOW 0 32 64 Left 0
WINDOW 3 32 0 Left 0
SYMATTR InstName D4
SYMATTR Value Dd
SYMBOL cap -288 32 M0
WINDOW 0 32 0 Left 0
WINDOW 3 32 64 Left 0
SYMATTR InstName C2
SYMATTR Value 10p
SYMBOL Digital\\diffschmitt -192 -48 R0
WINDOW 0 32 24 Center 0
WINDOW 3 32 0 Center 0
WINDOW 123 32 112 Center 0
WINDOW 39 32 136 Center 0
WINDOW 40 32 160 Center 0
SYMATTR InstName A3
SYMATTR Value Vt=1.9 Vh=0.4
SYMATTR Value2 Trise=50n
SYMATTR SpiceLine Tfall=2n
SYMATTR SpiceLine2 tripdt=2n
SYMBOL Digital\\diffschmtbuf -32 -80 R0
WINDOW 0 32 24 Center 0
WINDOW 3 0 112 Left 0
WINDOW 123 0 136 Left 0
SYMATTR InstName A4
SYMATTR Value Vt=0 Vh=0
SYMATTR Value2 Td=80n tripdt=5n
SYMBOL Digital\\diffschmtbuf -32 64 R0
WINDOW 0 32 24 Center 0
WINDOW 3 0 112 Left 0
WINDOW 123 0 136 Left 0
SYMATTR InstName A5
SYMATTR Value Vt=0 Vh=0
SYMATTR Value2 Td=80n tripdt=5n
SYMBOL bi -304 272 R270
WINDOW 0 -48 40 VCenter 0
WINDOW 3 72 40 VCenter 0
WINDOW 123 48 40 VCenter 0
SYMATTR InstName B1
SYMATTR Value I=table(V(DT,Com)/V(Vcc,Com),359m,9m,360m,
SYMATTR Value2 7m,569m,7m,570m,5m,889m,5m,890m,3m)
SYMBOL cap -48 256 M90
WINDOW 0 0 16 VLeft 0
WINDOW 3 0 48 VRight 0
WINDOW 39 35 32 VTop 0
SYMATTR InstName C3
SYMATTR Value 1n
SYMATTR SpiceLine Rpar=100
SYMBOL sw -224 368 R270
WINDOW 0 24 16 VLeft 0
WINDOW 3 24 96 VRight 0
SYMATTR InstName S2
SYMATTR Value Ref
SYMBOL Digital\\diffschmtbuf -32 656 M180
WINDOW 0 32 104 Center 0
WINDOW 3 32 16 Center 0
WINDOW 123 32 -8 Center 0
WINDOW 39 32 -32 Center 0
SYMATTR InstName A6
SYMATTR Value Vt=-0 Vh=0
SYMATTR Value2 Td=50n tripdt=10n
SYMATTR SpiceLine Rout=1k Cout=200p
SYMBOL Digital\\srflop 144 -304 R0
WINDOW 0 0 0 Center 0
WINDOW 3 0 144 Center 0
SYMATTR InstName A7
SYMATTR Value Td=100n tripdt=10n
SYMBOL Digital\\and 144 -32 R180
WINDOW 0 -8 64 Center 0
WINDOW 3 -8 16 Center 0
WINDOW 123 -8 -4 Center 0
WINDOW 39 -8 -29 Center 0
SYMATTR InstName A8
SYMATTR Value Ref=.37
SYMATTR Value2 Td=500n
SYMATTR SpiceLine tripdt=10n
SYMBOL Digital\\and 352 -64 R0
WINDOW 0 0 16 Center 0
WINDOW 3 0 -8 Center 0
WINDOW 123 0 -32 Center 0
SYMATTR InstName A9
SYMATTR Value Tau=5n
SYMATTR Value2 tripdt=5n
SYMBOL Digital\\diffschmtbuf 384 64 M0
WINDOW 0 32 24 Center 0
WINDOW 3 32 112 Center 0
WINDOW 123 32 136 Center 0
SYMATTR InstName A10
SYMATTR Value Vt=8.4 Vh=.1
SYMATTR Value2 Td=50n tripdt=10n
SYMBOL Digital\\diffschmtbuf 384 336 M0
WINDOW 0 32 24 Center 0
WINDOW 3 32 -24 Center 0
WINDOW 123 32 -48 Center 0
SYMATTR InstName A11
SYMATTR Value Vt=8.45 Vh=.25
SYMATTR Value2 Td=50n tripdt=10n
SYMBOL Digital\\diffschmtbuf 384 528 M0
WINDOW 0 32 24 Center 0
WINDOW 3 32 0 Center 0
WINDOW 123 32 -24 Center 0
SYMATTR InstName A12
SYMATTR Value Vt=8.8 Vh=.1
SYMATTR Value2 Td=50n tripdt=10n
SYMBOL Digital\\and 352 656 R0
WINDOW 0 0 16 Center 0
WINDOW 3 0 128 Center 0
WINDOW 123 0 152 Center 0
SYMATTR InstName A13
SYMATTR Value Tau=5n
SYMATTR Value2 tripdt=5n
SYMBOL Digital\\diffschmtbuf 512 -288 R180
WINDOW 0 32 104 Center 0
WINDOW 3 32 16 Center 0
WINDOW 123 32 -8 Center 0
WINDOW 39 32 -32 Center 0
SYMATTR InstName A14
SYMATTR Value Vt=-1.2 Vh=0
SYMATTR Value2 Td=50n tripdt=10n
SYMATTR SpiceLine Rout=1k Cout=300p
SYMBOL sw 544 -16 M180
WINDOW 0 32 80 Left 0
WINDOW 3 32 16 Left 0
SYMATTR InstName S3
SYMATTR Value SH
SYMBOL sw 544 16 R0
WINDOW 0 32 16 Left 0
WINDOW 3 32 80 Left 0
SYMATTR InstName S4
SYMATTR Value SL
SYMBOL sw 544 704 M180
WINDOW 0 32 80 Left 0
WINDOW 3 32 16 Left 0
SYMATTR InstName S5
SYMATTR Value SH
SYMBOL sw 544 736 R0
WINDOW 0 32 16 Left 0
WINDOW 3 32 80 Left 0
SYMATTR InstName S6
SYMATTR Value SL
SYMBOL diode -368 464 R180
WINDOW 0 32 64 Left 0
WINDOW 3 32 0 Left 0
SYMATTR InstName D5
SYMATTR Value Dd
SYMBOL cap -288 400 M0
WINDOW 0 32 0 Left 0
WINDOW 3 32 64 Left 0
WINDOW 39 32 128 Center 0
SYMATTR InstName C4
SYMATTR Value 10p
SYMATTR SpiceLine Rpar=1e6
SYMBOL cap -288 752 M0
WINDOW 0 32 0 Left 0
WINDOW 3 32 64 Left 0
WINDOW 39 32 128 Center 0
SYMATTR InstName C5
SYMATTR Value 10p
SYMATTR SpiceLine Rpar=1e6
SYMBOL cap 608 -320 R0
WINDOW 0 32 0 Left 0
WINDOW 3 32 64 Left 0
WINDOW 39 32 128 Center 0
SYMATTR InstName C6
SYMATTR Value 10p
SYMATTR SpiceLine Rpar=1e6
SYMBOL cap 608 -96 R0
WINDOW 0 32 0 Left 0
WINDOW 3 32 64 Left 0
SYMATTR InstName C7
SYMATTR Value 22p
SYMBOL cap 608 32 R0
WINDOW 0 32 0 Left 0
WINDOW 3 32 64 Left 0
WINDOW 39 32 128 Center 0
SYMATTR InstName C8
SYMATTR Value 27p
SYMATTR SpiceLine Rpar=100k
SYMBOL cap 608 624 R0
WINDOW 0 32 0 Left 0
WINDOW 3 32 64 Left 0
SYMATTR InstName C9
SYMATTR Value 22p
SYMBOL cap 608 752 R0
WINDOW 0 32 0 Left 0
WINDOW 3 32 64 Left 0
WINDOW 39 32 128 Center 0
SYMATTR InstName C10
SYMATTR Value 27p
SYMATTR SpiceLine Rpar=100k
SYMBOL diode -368 688 R180
WINDOW 0 32 64 Left 0
WINDOW 3 32 0 Left 0
SYMATTR InstName D6
SYMATTR Value Dd
SYMBOL diode -368 816 R180
WINDOW 0 32 64 Left 0
WINDOW 3 32 0 Left 0
SYMATTR InstName D7
SYMATTR Value Dd
SYMBOL diode 384 -256 R180
WINDOW 0 32 64 Left 0
WINDOW 3 32 0 Left 0
SYMATTR InstName D8
SYMATTR Value Di
SYMBOL diode 192 688 R180
WINDOW 0 32 64 Left 0
WINDOW 3 32 0 Left 0
SYMATTR InstName D9
SYMATTR Value Di
SYMBOL diode 688 -400 M180
WINDOW 0 32 64 Left 0
WINDOW 3 32 0 Left 0
SYMATTR InstName D10
SYMATTR Value Dd
SYMBOL diode 688 -256 M180
WINDOW 0 32 64 Left 0
WINDOW 3 32 0 Left 0
SYMATTR InstName D11
SYMATTR Value Dd
SYMBOL diode 688 -32 M180
WINDOW 0 32 64 Left 0
WINDOW 3 32 0 Left 0
SYMATTR InstName D12
SYMATTR Value Dd
SYMBOL diode 688 96 M180
WINDOW 0 32 64 Left 0
WINDOW 3 32 0 Left 0
SYMATTR InstName D13
SYMATTR Value Dd
SYMBOL zener 640 304 R180
WINDOW 0 0 64 Right 0
WINDOW 3 0 0 Right 0
SYMATTR InstName D14
SYMATTR Value 220V
SYMBOL zener 720 304 R180
WINDOW 0 0 64 Right 0
WINDOW 3 0 0 Right 0
SYMATTR InstName D15
SYMATTR Value 20Vb
SYMBOL zener 528 432 R180
WINDOW 0 32 64 Left 0
WINDOW 3 32 0 Left 0
SYMATTR InstName D16
SYMATTR Value 10V
SYMBOL zener 608 352 M270
WINDOW 0 36 32 VTop 0
WINDOW 3 -4 32 VBottom 0
SYMATTR InstName D17
SYMATTR Value 210V
SYMBOL zener 720 480 R180
WINDOW 0 0 64 Right 0
WINDOW 3 0 0 Right 0
SYMATTR InstName D18
SYMATTR Value 20V
SYMBOL diode 688 688 M180
WINDOW 0 32 64 Left 0
WINDOW 3 32 0 Left 0
SYMATTR InstName D19
SYMATTR Value Dd
SYMBOL diode 688 816 M180
WINDOW 0 32 64 Left 0
WINDOW 3 32 0 Left 0
SYMATTR InstName D20
SYMATTR Value Dd
TEXT 160 -576 Center 0 ;>> IRS20954 Behavioral Model by analog@ieee.org 8/2006 Rev - <<
TEXT -224 768 Left 0 !.model Di d(Ron=10)\n.model Dd d(Ron=.5 Vfwd=.5)\n.model 10V d(Ron=.5 Vfwd=.5 Vrev=10.4 Roff=12k)\n.model 20V d(Ron=.5 Vfwd=.5 Vrev=20.2 Roff=7k)\n.model 20Vb d(Ron=.5 Vfwd=.5 Vrev=20.2 Roff=22k)\n.model 210V d(Ron=.5 Vfwd=.5 Vrev=210 Roff=5e6)\n.model 220V d(Ron=.5 Vfwd=.5 Vrev=220 Roff=5e6)
TEXT 192 -480 Left 0 !.model SH sw(Vt=.5 Vh=-.5 Ron=5 Ilimit=1.0 Vser=1.2)\n.model SL sw(Vt=.5 Vh=-.5 Ron=3 Ilimit=1.2)
TEXT -264 -160 Left 0 !.model Isw sw\n+ Vt=-.5\n+ Ilimit=200u\n+ Vser=.6
TEXT -128 400 Left 0 !.model Ref sw\n+ Vt=-5.1\n+ Vh=-50m\n+ Vser=1.2\n+ Ron=10
TEXT -80 168 Right 0 ;Deadtime Generator
RECTANGLE Normal 816 928 -496 -560

The netlist it stands for:
* CIRCUITO_FINAL_POTENCIA.asc
V2 Vcc 0 12
V4 VDD 0 60
Lf Vo1 Vf 2m
Cf Vf 0 1µ
V7 5V 0 5
V8 Vss 0 -5
R9 N028 N006 {R_2}
R10 Vo N028 {R_1}
C3 0 N028 {C_1}
C4 N029 N006 {C_2}
R11 Vo N029 {R_3}
Rp V_error N006 {Rp}
Cp V_error N006 {Cp}
XU4 0 N006 5V Vss V_error TL084  ; pins In+ In- V+ V- OUT
XU5 V_error Triangular 5V Vss PWM LM393  ; pins In+ In- V+ V- OUT
R14 5V PWM 3k
R8 N008 N012 {Rg}
R23 N012 N014 {Rg}
R24 N006 N008 {Rg}
XU3 0 N012 5V Vss N008 TL084  ; pins In+ In- V+ V- OUT
C1 N013 Vo1 22n
Ct1 N015 0 10p
C2 Vcc 0 22n
XM1 VDD N017 Vo1 irf510  ; pins D G S
RD1 N013 N020 0.1
RG1 N017 N016 22
RG2 N026 N025 22
R3 N010 Vo1 3.3k
R2 N011 N010 6.8k
R1 N013 N011 10k
R5 N024 0 5.6k
R4 N022 N024 4.7k
XX1 N009 PWM N015 0 N022 N024 N027 0 N025 Vcc Vo1 N016 N013 N010 irs20954 params: IRS20954
V3 Triangular 0 PULSE(-4 4 0 2.5u 2.5u 0 5u)
D6 Vo1 VDD MUR460
D7 0 Vo1 MUR460
D2 N011 VDD BAV21
Cgs1 N017 Vo1 1n
Cgs2 N026 0 1n
D1 Vcc N020 1N4448
R7 N027 0 3.3k
R6 Vcc N027 8.2k
V5 Vin 0 2
XM2 Vo1 N026 0 irf510  ; pins D G S
RL 0 Vo 24
Rs Vo Vf 0.1
R12 Vf N001 9k
R13 N001 0 1k
R15 Vo N002 9k
R16 N002 0 1k
R17 A N002 90k
R18 N001 Vlim 90k
Q1 N003 N004 N006 0 BC547B
Q2 Vss A N004 0 BC557B
R19 5V N004 100k
D3 P001 0 NSPW500BS
R20 5V N003 10k
Q3 N005 N003 5V 0 BC557B
R21 N005 P001 1k
C5 N003 5V 100n
D4 N007 A 1N4148
D5 N007 N006 1N750
XU1 N001 N002 5V Vss A TL084  ; pins In+ In- V+ V- OUT
Rs1 N023 N006 {Rs}
Cs1 V_error N023 {Cs}
XU6 N021 N018 5V Vss N019 TL084  ; pins In+ In- V+ V- OUT
RA N019 N018 200k
D9 N014 N019 1N4448
RC N014 Vin 100
RB N014 N018 200k
RA1 N021 5V 68k
RA2 0 N021 33k
R22 N009 VDD 2.2k
V1 Vlim 0 -2.5

* block symbol definitions
.subckt irs20954 Vdd In CSD Vss Vref OCset DT Com Lo Vcc Vs Ho Vb CsH
D1 CSD Vdd Dd
D2 Vss CSD Dd
C1 CSD Vss 10p Rpar=1e6
I1 Vdd CSD TBL(1.2 0 1.3 100u)
S1 Vss CSD 0 7 Isw
R1 Vdd 1 30k
R2 2 1 40k
R3 2 Vss 30k
A1 CSD 1 0 0 0 0 6 0 SCHMITT Vt=0 Vh=0 Td=300n tripdt=10n
A2 2 CSD 0 0 0 0 8 0 SCHMITT Vt=0 Vh=0 Td=200n tripdt=10n
D3 In Vdd Dd
D4 Vss In Dd
C2 In Vss 10p
A3 In Vss 0 0 0 4 3 0 SCHMITT Vt=1.9 Vh=0.4 Trise=50n Tfall=2n tripdt=2n
A4 3 5 0 0 0 0 10 0 SCHMITT Vt=0 Vh=0 Td=80n tripdt=5n
A5 4 5 0 0 0 0 11 0 SCHMITT Vt=0 Vh=0 Td=80n tripdt=5n
B1 0 5 I=table(V(DT,Com)/V(Vcc,Com),359m,9m,360m, 7m,569m,7m,570m,5m,889m,5m,890m,3m)
C3 5 0 1n Rpar=100
S2 Vref Vcc Com Vref Ref
A6 OCset Vs 0 0 0 0 12 0 SCHMITT Vt=-0 Vh=0 Td=50n tripdt=10n Rout=1k Cout=200p
A7 8 9 0 0 0 0 7 0 SRFLOP Td=100n tripdt=10n
A8 12 16 15 14 13 9 0 0 AND Ref=.37 Td=500n tripdt=10n
A9 0 10 6 7 14 18 17 0 AND Tau=5n tripdt=5n
A10 Vb Vs 0 0 0 0 14 0 SCHMITT Vt=8.4 Vh=.1 Td=50n tripdt=10n
A11 Vdd Vss 0 0 0 0 15 0 SCHMITT Vt=8.45 Vh=.25 Td=50n tripdt=10n
A12 Vcc Com 0 0 0 0 16 0 SCHMITT Vt=8.8 Vh=.1 Td=50n tripdt=10n
A13 16 6 7 11 0 20 19 0 AND Tau=5n tripdt=5n
A14 Vs CsH 0 0 0 0 13 0 SCHMITT Vt=-1.2 Vh=0 Td=50n tripdt=10n Rout=1k Cout=300p
S3 Ho Vb 17 0 SH
S4 Ho Vs 18 0 SL
S5 Lo Vcc 19 0 SH
S6 Lo Com 20 0 SL
D5 Com Vref Dd
C4 Vref Com 10p Rpar=1e6
C5 OCset Com 10p Rpar=1e6
C6 CsH Vs 10p Rpar=1e6
C7 Vb Ho 22p
C8 Ho Vs 27p Rpar=100k
C9 Vcc Lo 22p
C10 Lo Com 27p Rpar=100k
D6 OCset Vcc Dd
D7 Com OCset Dd
D8 18 13 Di
D9 20 12 Di
D10 CsH Vb Dd
D11 Vs CsH Dd
D12 Ho Vb Dd
D13 Vs Ho Dd
D14 Com Vb 220V
D15 Vs Vb 20Vb
D16 Vss Vdd 10V
D17 Com Vdd 210V
D18 Com Vcc 20V
D19 Lo Vcc Dd
D20 Com Lo Dd
* >> IRS20954 Behavioral Model by analog@ieee.org 8/2006 Rev - <<
.model Di d(Ron=10)
.model Dd d(Ron=.5 Vfwd=.5)
.model 10V d(Ron=.5 Vfwd=.5 Vrev=10.4 Roff=12k)
.model 20V d(Ron=.5 Vfwd=.5 Vrev=20.2 Roff=7k)
.model 20Vb d(Ron=.5 Vfwd=.5 Vrev=20.2 Roff=22k)
.model 210V d(Ron=.5 Vfwd=.5 Vrev=210 Roff=5e6)
.model 220V d(Ron=.5 Vfwd=.5 Vrev=220 Roff=5e6)
.model SH sw(Vt=.5 Vh=-.5 Ron=5 Ilimit=1.0 Vser=1.2)
.model SL sw(Vt=.5 Vh=-.5 Ron=3 Ilimit=1.2)
.model Isw sw
+ Vt=-.5
+ Ilimit=200u
+ Vser=.6
.model Ref sw
+ Vt=-5.1
+ Vh=-50m
+ Vser=1.2
+ Ron=10
* Deadtime Generator
.ends irs20954

.model D D
.lib standard.dio
.model NPN NPN
.model PNP PNP
.lib standard.bjt
* Vb Zos: 220V
* VddZos: 210V
* VccZ: 20.2V
* Vb Z: 20.2V
* VddZ: 10.4V
* Td on: 90ns+Tdt
* Td off: 90ns
* Tsd:  < 1us
* Tr on: 15ns
* Tf off: 10ns
* Tdt: 15/25/35/45ns
* Vdt: .89/.57/.36/.23
* VHin: 2.3
* VLin: 1.5
* VHsat: 1.2
* Ros: 5e6
* Rb: 12k
* Rcc: 7k
* Rdd: 22k
* Rin: 1e6
* UVL Vcc: 8.9/8.7V
* UVL Vb:  8.5/8.3V
* UVL Vdd: 8.7/8.2V
* Io+: 1.0A
* Io-: 1.2A
* Voc: 70/30 %Vdd
* Ioc: +/-100ua
* OCH: 1.2Vos
*  300ns filter
* OCL: 0.0Vos
*  200ns filter
.model MUR460 D(Is=149n Rs=.0384 N=2 EG=1.285 XTI=.5 BV=800
+ IBV=1e-05 Cjo=126.4p Vj=1.34 M=.52 tt=44.4n Iave=4 Vpk=600 mfg=GI type=silicon)
.MODEL BAV21W D  ( IS=1.09u RS=0.105 BV=200 IBV=100n
+ CJO=5.00p  M=0.333 N=3.29 TT=72.0n )
.include LM393.5_1
.include TL084.301
.param Rg=10k
.MODEL BAV21 D  ( IS=1.09u RS=0.105 BV=200 IBV=100n
+ CJO=5.00p  M=0.333 N=3.29 TT=72.0n )
.MODEL 1N4448 D (IS=2.22E-10 N=1.70 BV=1.00E+02 IBV=5.00E-05
+ RS=2.10E-01 CJO=4.00E-12 VJ=.75 M=.333 TT=5.76E-09)
.include irf510.lib.txt
.param R_1=50k R_2=250k
+ R_3=1k C_1=10p C_2=0.15n
* Amplificador inversor
.param Rp=220k Cp=1p
+Rs=100k Cs=200p
* Amplificador relimentado por
* corriente con compensador PID
* Comparador
* Half bridge con Gate Driver
* Bloque realimentador f
.tran 0 10m 0m 1m uic
* Limitador de corriente
* Recortador de tension
.model D1N746 D(Is=31.47f Rs=9.494 Ikf=0 N=1 Xti=3 Eg=1.11 Cjo=220p M=.5959 Vj=.75 Fc=.5 Isr=2.035n Nr=2 Bv=3.3 Ibv=45.862m Nbv=3.0477 Ibvl=29.831m Nbvl=11.606 Tbv1=-636.4u)
.model D1N5229 D(Is=880.5E-18 Rs=.25 Ikf=0 N=1 Xti=3 Eg=1.11 Cjo=190p M=.6124
+ Vj=.75 Fc=.5 Isr=1.743n Nr=2 Bv=4.3 Ibv=16.748m Nbv=1.7936
+ Ibvl=5.0382m Nbvl=12.554 Tbv1=-232.56u)
.backanno
.end